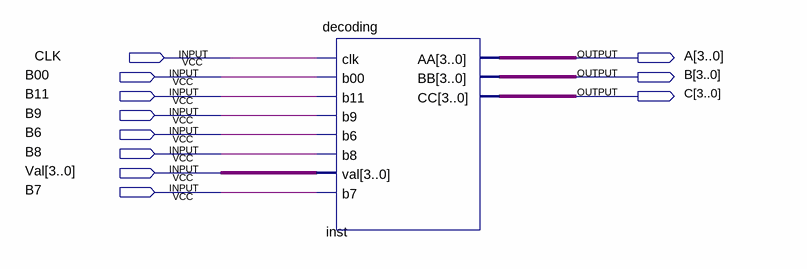
[diagram p0: schematic sheet]
// Quartus schematic Assignment2.bdf as structural Verilog: 1 symbols, 11 pins
module Assignment2 (
  input  CLK,
  input  B00,
  input  B11,
  input  B9,
  input  B6,
  input  B8,
  input  [3:0] Val,
  input  B7,
  output [3:0] A,
  output [3:0] B,
  output [3:0] C
);

  decoding inst (
    .clk(CLK), .b00(B00), .b11(B11), .b9(B9), .b6(B6), .b8(B8), .val(Val), .b7(B7), .AA(A), .BB(B), .CC(C));
endmodule
